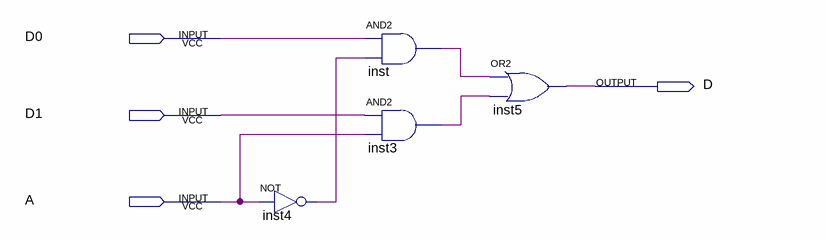
[diagram p0: schematic sheet]
// Quartus schematic mux_2x1.bdf as structural Verilog: 4 symbols, 4 pins
module mux_2x1 (
  input  D0,
  input  D1,
  input  A,
  output D
);

  wire inst3_out, inst4_out, inst_out;

  not inst4 (inst4_out, A);
  and inst (inst_out, D0, inst4_out);
  and inst3 (inst3_out, D1, A);
  or inst5 (D, inst_out, inst3_out);
endmodule
